# EAGLE schematic MEMS-preamp_v13 (EAGLE 8.5.0)

## Sheet 1 of 2
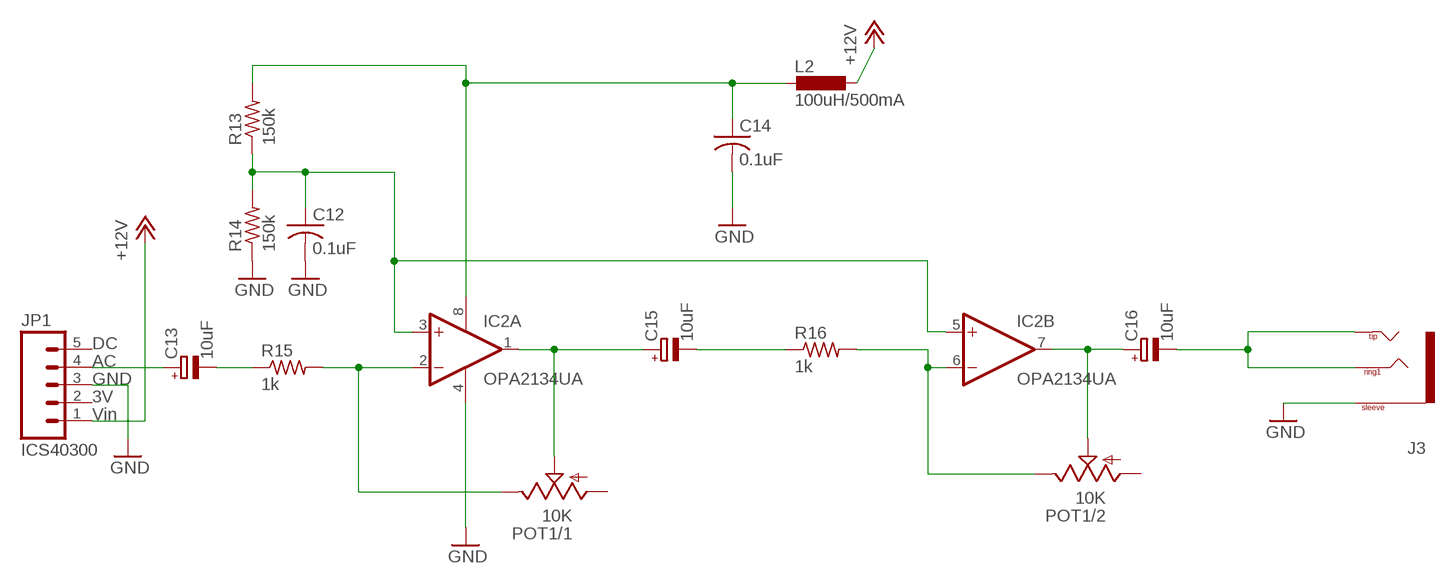
[diagram p0: schematic, sheet 1]

### Parts
C12  0.1uF  C-USC0805  [C0805]
C13  10uF  CPOL-EUB  [PANASONIC_B]
C14  0.1uF  C-USC0805K  [C0805K]
C15  10uF  CPOL-EUB  [PANASONIC_B]
C16  10uF  CPOL-EUB  [PANASONIC_B]
IC2  OPA2134UA  [SO08]
J3  TRS-1/8"-3.5MM  [TRS_SJ-3524-SMT]
JP1  ICS40300  M05SMD_2.54MM  [1X05_SMD_STRAIGHT]
L2  100uH/500mA  L-EUL3225M  [L3225M]
POT1  10K  POT-DUAL-PTV112-4420  [PTV112]
R13  150k  R-US_R0603  [R0603]
R14  150k  R-US_R0603  [R0603]
R15  1k  R-US_R0603  [R0603]
R16  1k  R-US_R0603  [R0603]

### Nets
+12V: JP1.1 L2.1 ; also sheet 2
GND: C12.2 C14.2 IC2.4(A:V-) J3.1(SLEEVE) JP1.3 R14.1 ; also sheet 2
N$3: C13.+ JP1.4
N$4: C15.- R16.1
N$5: IC2.2(A:-IN) POT1.1.3(/1:E) R15.2
N$7: C16.- J3.2(TIP) J3.3(RING1) J3.4(TIP)
N$8: C12.1 IC2.3(A:+IN) IC2.5(B:+IN) R13.1 R14.2
N$9: C15.+ IC2.1(A:OUT) POT1.1.2(/1:S)
N$10: C16.+ IC2.7(B:OUT) POT1.2.2(/2:S)
N$15: C14.1 IC2.8(A:V+) L2.2 R13.2
N$21: IC2.6(B:-IN) POT1.2.3(/2:E) R16.2
N$23: C13.- R15.1
Unconnected: JP1.2 JP1.5 POT1.1.1(/1:A) POT1.2.1(/2:A)

## Sheet 2 of 2
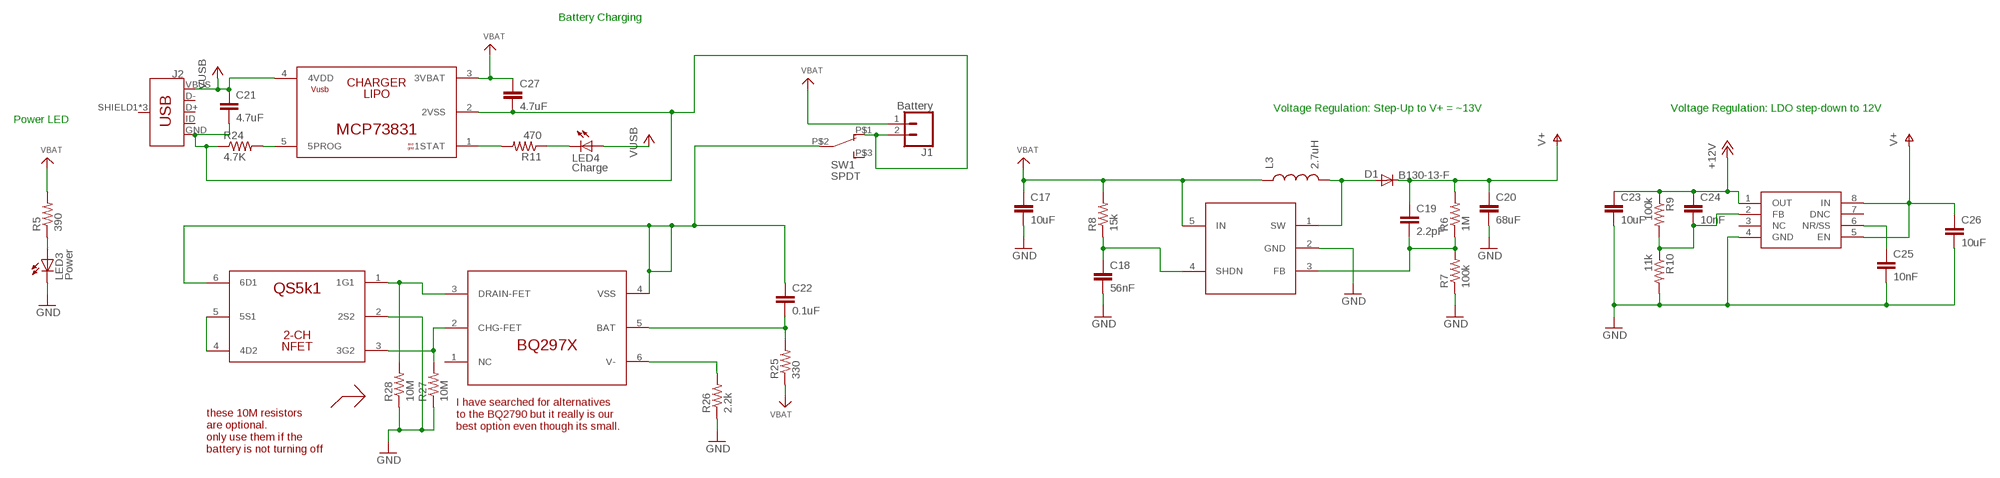
[diagram p1: schematic, sheet 2]

### Parts
C17  10uF  C-EUC0603  [C0603]
C18  56nF  C-EUC0603  [C0603]
C19  2.2pF  C-EUC0603  [C0603]
C20  68uF  C-EUC1206  [C1206]
C21  4.7uF  C-EUC0603  [C0603]
C22  0.1uF  C-EUC0603  [C0603]
C23  10uF  C-EUC0603  [C0603]
C24  10nF  C-EUC0603  [C0603]
C25  10nF  C-EUC0603  [C0603]
C26  10uF  C-EUC0603  [C0603]
C27  4.7uF  C-EUC0603  [C0603]
D1  B130-13-F  DIODESMA  [SMA-DIODE]
IC7  TPS7A49  [MSOP-8]
IC8  BQ297X  BQ297X-BATTERY-MANAGERLONG  [WSON-6-LONG]
IC9  SC4503  [SOT23-5]
IC10  MCP73831  [SOT-23-5]
IC11  QS6K1  [SOT457R_PHILIPS]
J1  Battery  CONN_02LOCK  [1X02_LOCK]
J2  USB_MICRO-BREDUCED_PASTE  [USB-B-MICRO-SMD_RED_PASTE]
L3  2.7uH  INDUCTORCR54  [CR54]
LED3  Power  LED3MM  [LED3MM]
LED4  Charge  LED3MM  [LED3MM]
R5  390  R-US_R0603  [R0603]
R6  1M  R-US_R0603  [R0603]
R7  100k  R-US_R0603  [R0603]
R8  15k  R-US_R0603  [R0603]
R9  100k  R-US_R0603  [R0603]
R10  11k  R-US_R0603  [R0603]
R11  470  R-US_R0603  [R0603]
R24  4.7K  R-US_R0603  [R0603]
R25  330  R-US_R0603  [R0603]
R26  2.2k  R-US_R0603  [R0603]
R27  10M  R-US_R0603  [R0603]
R28  10M  R-US_R0603  [R0603]
SW1  SPDT  SWITCH_SPDTCL-SB-12B  [SWITCH_SPDT_CL-SB-12B]

### Nets
+5V: C21.1 IC10.4(4VDD) J2.VBUS LED4.A ; supply symbol labelled VUSB
+12V: C23.1 C24.1 IC7.1(OUT) R9.1 ; also sheet 1
BATGND1: C22.1 IC8.4(VSS) IC11.6(6D1) SW1.P$2
GND: C17.2 C18.2 C20.2 C23.2 C25.2 C26.2 IC7.4(GND) IC9.2(GND) IC11.2(2S2) LED3.K(C) R7.1 R10.2 R26.1 R27.1 R28.1 ; also sheet 1
N$6: LED3.A R5.1
N$11: D1.A IC9.1(SW) L3.P$2
N$12: C18.1 IC9.4(SHDN) R8.1
N$13: C19.2 IC9.3(FB) R6.1 R7.2
N$14: C24.2 IC7.2(FB) R9.2 R10.1
N$16: C25.1 IC7.6(NR/SS)
N$17: LED4.K(C) R11.1
N$19: C22.2 IC8.5(BAT) R25.2
N$20: IC10.5(5PROG) R24.2
N$24: IC10.1(1STAT) R11.2
N$33: IC11.4(4D2) IC11.5(5S1)
N$35: IC8.3(DRAIN-FET) IC11.1(1G1) R28.2
N$36: IC8.2(CHG-FET) IC11.3(3G2) R27.2
N$37: IC8.6(V-) R26.2
USBGND1: C21.2 C27.2 IC10.2(2VSS) J1.2 J2.GND R24.1 SW1.P$1
V+: C19.1 C20.1 C26.1 D1.C IC7.5(EN) IC7.8(IN) R6.2
VBAT: C17.1 C27.1 IC9.5(IN) IC10.3(3VBAT) J1.1 L3.P$1 R5.2 R8.2 R25.1
Unconnected: IC7.3(NC) IC7.7(DNC) IC8.1(NC) J2.D+ J2.D- J2.ID J2.SHIELD1(SHIELD) J2.SHIELD2(SHIELD) J2.SHIELD3(SHIELD) SW1.P$3

### Notes on the sheet
- Battery Charging
- Voltage Regulation: Step-Up to V+ = ~13V | Voltage Regulation: LDO step-down to 12V
- Power LED
- I have searched for alternatives 
  to the BQ2790 but it really is our 
  best option even though its small.
- these 10M resistors
  are optional. 
  only use them if the 
  battery is not turning off

## Library data of the parts
C12 C14 = adafruit:C-US: CAPACITOR, American symbol
C13 C15 C16 = CMU-ArtFab:CPOL-EU: POLARIZED CAPACITOR, European symbol
C17-C27 = rcl:C-EU: CAPACITOR, European symbol; SPICEPREFIX: C
D1 = SparkFun:DIODE: Diode These are standard reverse protection diodes and small signal diodes. SMA package can handle up to about 1A. SOD-323 can handle about 200mA. What the SOD-323 package when ordering, there are some mfgs out there that are 5-pin packages.
IC2 = linear:OPA2*: Dual Operational Amplifier Low Power, Single-Supply, Rail-To-Rail Operational Amplifier Source: http://focus.ti.com/lit/ds/symlink/opa2345.pdf http://focus.ti.com .. opa241.pdf http://focus.ti.com/lit/ds/symlink/opa2134.pdf
IC7 = CMU-ArtFab:TPS7A49
IC8 = CMU-ArtFab:BQ297X-BATTERY-MANAGER
IC9 = CMU-ArtFab:SC4503
IC10 = CMU-ArtFab:MCP73831
IC11 = CMU-ArtFab:QS6K1
J1 = SparkFun-Connectors:CONN_02: Multi connection point. Often used as Generic Header-pin footprint for 0.1 inch spaced/style header connections On any of the 0.1 inch spaced packages, you can populate with these: Break Away Headers - Straight <https://www.sparkfun.com/products/116> (PRT-00116) Break Away Male Headers - Right Angle <https://www.sparkfun.com/products/553> (PRT-00553) Female Headers <https://www.sparkfun.com/products/115> (PRT-00115) Break Away Headers - Machine Pin <https://www.sparkfun.com/products/117> (PRT-00117) Break Away Female Headers - Swiss Machine Pin <https://www.sparkfun.com/products/743> (PRT-00743) For SCREWTERMINALS and SPRING TERMINALS visit here: Screw Terimnals on SparkFun.com <https://www.sparkfun.com/search/results?term=Screw+Terminals> (5mm/3.5mm/2.54mm spacing) This device is also useful as a general connection point to wire up your design to another part of your project. Our various solder wires solder well into these plated through hole pads. Hook-Up Wire - Assortment (Stranded, 22 AWG) <https://www.sparkfun.com/products/11375> (PRT-11375) Hook-Up Wire - Assortment (Solid Core, 22 AWG) <https://www.sparkfun.com/products/11367> (PRT-11367) View the entire wire category on our website here <https://www.sparkfun.com/categories/141> Special notes: Molex polarized connector foot print use with: PRT-08233 with associated crimp pins and housings. 2.54_SCREWTERM for use with PRT-10571. 3.5mm Screw Terminal footprints for PRT-08084 5mm Screw Terminal footprints for use with PRT-08432
J2 = CMU-ArtFab:USB_MICRO-B: USB Type Micro-B Connector Male/female and PTH/SMT variants SparkFun Products: SparkFun microB USB Breakout <https://www.sparkfun.com/products/12035> SparkFun USB microB Plug Breakout <https://www.sparkfun.com/products/10031> SparkFun ESP8266 Thing <https://www.sparkfun.com/products/13231>; PROD_ID: CONN-11752
J3 = CMU-ArtFab:TRS-1/8"-3.5MM
JP1 = CMU-ArtFab:M05: Multi connection point. Often used as Generic Header-pin footprint for 0.1 inch spaced/style header connections On any of the 0.1 inch spaced packages, you can populate with these: Break Away Headers - Straight <https://www.sparkfun.com/products/116> (PRT-00116) Break Away Male Headers - Right Angle <https://www.sparkfun.com/products/553> (PRT-00553) Female Headers <https://www.sparkfun.com/products/115> (PRT-00115) Break Away Headers - Machine Pin <https://www.sparkfun.com/products/117> (PRT-00117) Break Away Female Headers - Swiss Machine Pin <https://www.sparkfun.com/products/743> (PRT-00743) For SCREWTERMINALS and SPRING TERMINALS visit here: Screw Terimnals on SparkFun.com <https://www.sparkfun.com/search/results?term=Screw+Terminals> (5mm/3.5mm/2.54mm spacing) This device is also useful as a general connection point to wire up your design to another part of your project. Our various solder wires solder well into these plated through hole pads. Hook-Up Wire - Assortment (Stranded, 22 AWG) <https://www.sparkfun.com/products/11375> (PRT-11375) Hook-Up Wire - Assortment (Solid Core, 22 AWG) <https://www.sparkfun.com/products/11367> (PRT-11367) View the entire wire category on our website here <https://www.sparkfun.com/categories/141> Special notes: Molex polarized connector foot print use with SKU : PRT-08231 with associated crimp pins and housings. 1MM SMD Version SKU: PRT-10208; CON1: Vin; CON2: 3V; CON3: GND; CON4: AC; CON5: DC
L2 = rcl:L-EU: INDUCTOR, European symbol; SPICEPREFIX: L
L3 = SparkFun-Passives:INDUCTOR: Inductors Basic Inductor/Choke - 0603 and 1206. Footprints are not proven and vary greatly between part numbers. SRN6045- 33uH, 20% 1.4A SDR0403-560KL - 56uH, 10%, 500mA RMS/740mA peak
LED3 LED4 = led:LED: LED OSRAM: - CHIPLED LG R971, LG N971, LY N971, LG Q971, LY Q971, LO R971, LY R971 LH N974, LH R974 LS Q976, LO Q976, LY Q976 LO Q996 - Hyper CHIPLED LW Q18S LB Q993, LB Q99A, LB R99A - SideLED LS A670, LO A670, LY A670, LG A670, LP A670 LB A673, LV A673, LT A673, LW A673 LH A674 LY A675 LS A676, LA A676, LO A676, LY A676, LW A676 LS A679, LY A679, LG A679 - Hyper Micro SIDELED® LS Y876, LA Y876, LO Y876, LY Y876 LT Y87S - SmartLED LW L88C, LW L88S LB L89C, LB L89S, LG L890 LS L89K, LO L89K, LY L89K LS L896, LA L896, LO L896, LY L896 - TOPLED LS T670, LO T670, LY T670, LG T670, LP T670 LSG T670, LSP T670, LSY T670, LOP T670, LYG T670 LG T671, LOG T671, LSG T671 LB T673, LV T673, LT T673, LW T673 LH T674 LS T676, LA T676, LO T676, LY T676, LB T676, LH T676, LSB T676, LW T676 LB T67C, LV T67C, LT T67C, LS T67K, LO T67K, LY T67K, LW E67C LS E67B, LA E67B, LO E67B, LY E67B, LB E67C, LV E67C, LT E67C LW T67C LS T679, LY T679, LG T679 LS T770, LO T770, LY T770, LG T770, LP T770 LB T773, LV T773, LT T773, LW T773 LH T774 LS E675, LA E675, LY E675, LS T675 LS T776, LA T776, LO T776, LY T776, LB T776 LHGB T686 LT T68C, LB T68C - Hyper Mini TOPLED® LB M676 - Mini TOPLED Santana® LG M470 LS M47K, LO M47K, LY M47K Source: http://www.osram.convergy.de LUXEON: - LUMILED® LXK2-PW12-R00, LXK2-PW12-S00, LXK2-PW14-U00, LXK2-PW14-V00 LXK2-PM12-R00, LXK2-PM12-S00, LXK2-PM14-U00 LXK2-PE12-Q00, LXK2-PE12-R00, LXK2-PE12-S00, LXK2-PE14-T00, LXK2-PE14-U00 LXK2-PB12-K00, LXK2-PB12-L00, LXK2-PB12-M00, LXK2-PB14-N00, LXK2-PB14-P00, LXK2-PB14-Q00 LXK2-PR12-L00, LXK2-PR12-M00, LXK2-PR14-Q00, LXK2-PR14-R00 LXK2-PD12-Q00, LXK2-PD12-R00, LXK2-PD12-S00 LXK2-PH12-R00, LXK2-PH12-S00 LXK2-PL12-P00, LXK2-PL12-Q00, LXK2-PL12-R00 Source: www.luxeon.com KINGBRIGHT: KA-3528ASYC Source: www.kingbright.com
POT1 = CMU-ArtFab:POT-DUAL-PTV112: Bourns 11mm dual potentiometer; AVAILABILITY: Unavailable; DESCRIPTION: Alt# Tce-10111410; MF: STMicroelectronics; MP: PTV112; PACKAGE: None; PRICE: None
R5-R11 R13-R16 R24-R28 = CMU-ArtFab:R-US_: RESISTOR, American symbol
SW1 = CMU-ArtFab:SWITCH_SPDT